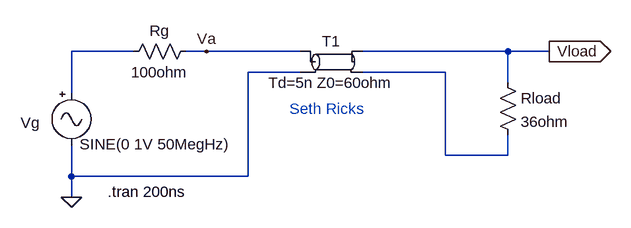
[diagram p0: schematic LTspice Transmission Line Lab Part 3.asc]
LTspice Transmission Line Lab Part 3.asc, the LTspice schematic file:
Version 4
SHEET 1 880 680
WIRE -240 160 -336 160
WIRE -128 160 -160 160
WIRE 16 160 -128 160
WIRE 336 160 112 160
WIRE 400 160 336 160
WIRE 16 192 -64 192
WIRE 240 192 112 192
WIRE 336 208 336 160
WIRE -336 224 -336 160
WIRE 240 320 240 192
WIRE 336 320 336 288
WIRE 336 320 240 320
WIRE -336 352 -336 304
WIRE -64 352 -64 192
WIRE -64 352 -336 352
WIRE -336 384 -336 352
FLAG -336 384 0
FLAG -128 160 Va
FLAG 400 160 Vload
IOPIN 400 160 Out
SYMBOL Misc\\signal -336 208 R0
WINDOW 0 -78 62 Left 2
WINDOW 3 13 95 Left 2
SYMATTR InstName Vg
SYMATTR Value SINE(0 1V 50MegHz)
SYMBOL tline 64 176 R0
SYMATTR InstName T1
SYMATTR Value Td=5n Z0=60ohm
SYMBOL res 320 192 R0
SYMATTR InstName Rload
SYMATTR Value 36ohm
SYMBOL res -144 144 R90
WINDOW 0 0 56 VBottom 2
WINDOW 3 32 56 VTop 2
SYMATTR InstName Rg
SYMATTR Value 100ohm
TEXT 0 248 Left 2 ;Seth Ricks
TEXT -280 376 Left 2 !.tran 200ns

The netlist it stands for:
* LTspice Transmission Line Lab Part 3.asc
Vg N001 0 SINE(0 1V 50MegHz)
T1 Va 0 Vload N002 Td=5n Z0=60ohm
Rload Vload N002 36ohm
Rg Va N001 100ohm
* Seth Ricks
.tran 200ns
.backanno
.end

* Results of the author's LTspice run, read from the files saved beside the schematic
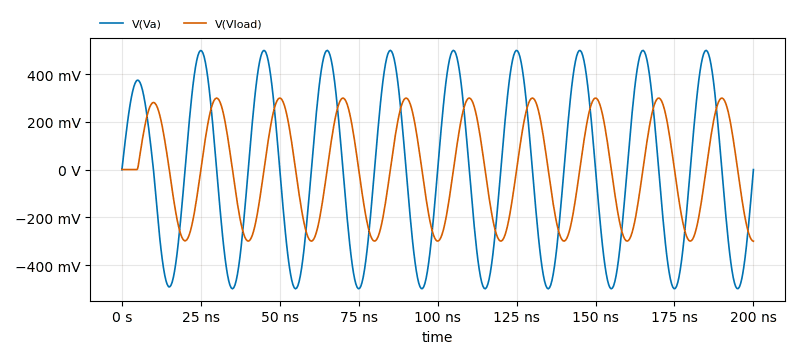
[diagram p1: Transient Analysis of LTspice Transmission Line Lab Part 3.asc, plotted from the saved traces]
* Transient Analysis, 1 run:
*   V(Va): min -499.5 mV, max 499.5 mV, average -3.739 mV, rms 349 mV, last -2.258 µV
*   V(Vload): min -300 mV, max 299.7 mV, average 4.209 mV, rms 208.6 mV, last -300 mV